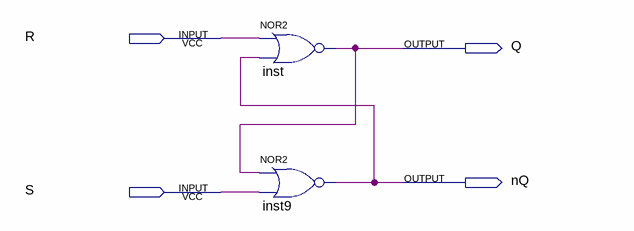
[diagram p0: schematic sheet]
// Quartus schematic latche.bdf as structural Verilog: 2 symbols, 4 pins
module latche (
  input  R,
  input  S,
  output Q,
  output nQ
);

  nor inst (Q, R, nQ);
  nor inst9 (nQ, Q, S);
endmodule
